# Altium project shutdown-rev2.PrjPCB
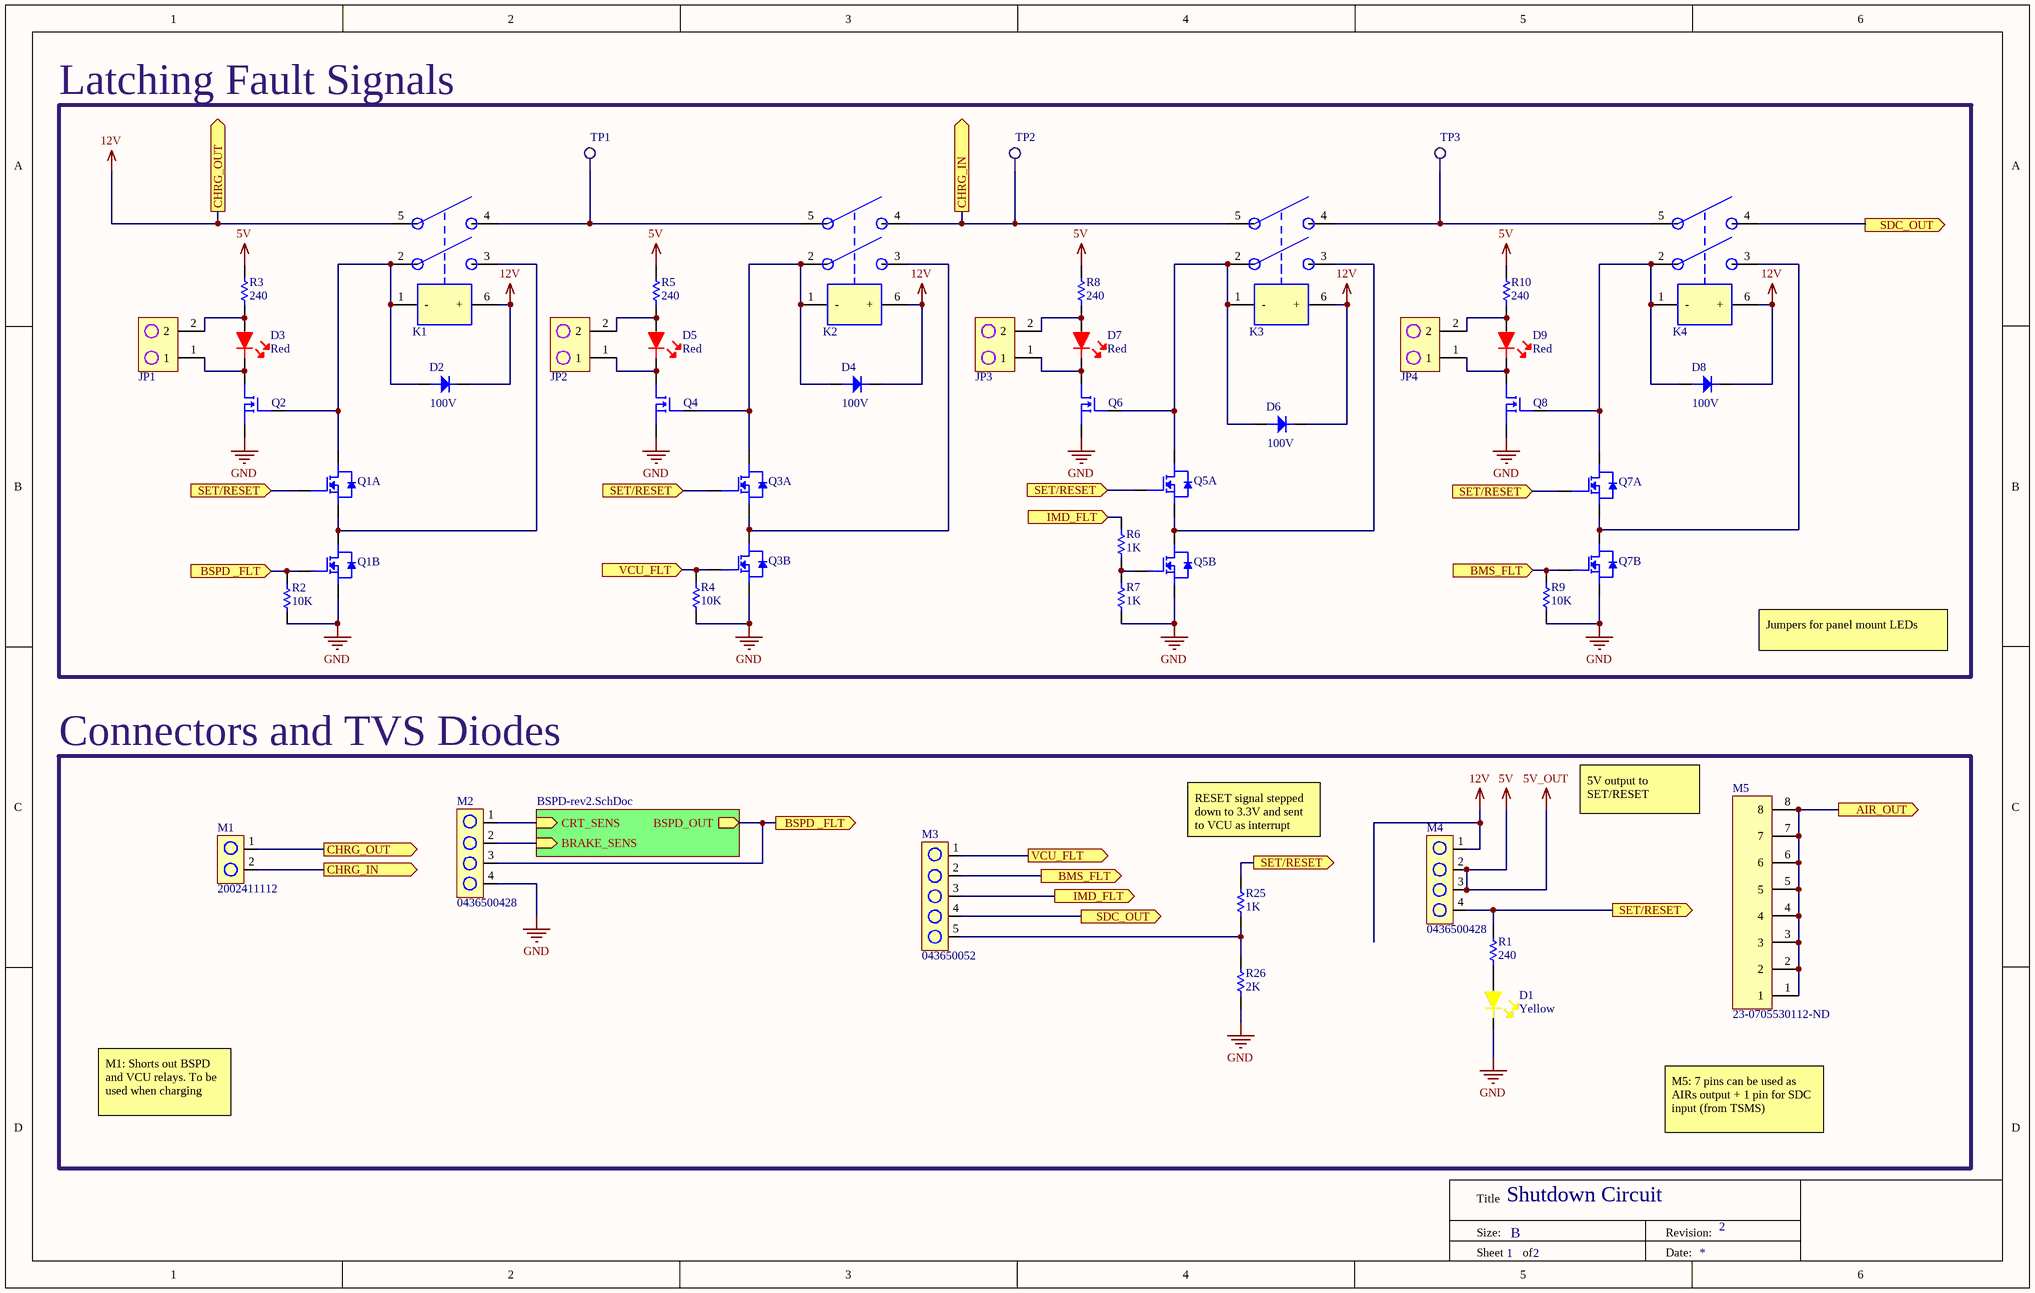
[diagram p0: SDC-rev2.SchDoc]
2 sheets, 79 parts. Net scope: hierarchical (ports join the sheet entries above them; power ports are global).
Board files: OLD_SDC-BSPD-rev2.PcbDoc, SDC-BSPD-rev2.PcbDoc
Sheets:
  SDC-rev2.SchDoc
    U_BSPD-rev2 = BSPD-rev2.SchDoc

## Sheet SDC-rev2.SchDoc
size B

### Parts
D1  Yellow  [LED-0603]
D2  100V  [DO-214AA]
D3  Red  [LED-0603]
D4  100V  [DO-214AA]
D5  Red  [LED-0603]
D6  100V  [DO-214AA]
D7  Red  [LED-0603]
D8  100V  [DO-214AA]
D9  Red  [LED-0603]
JP1  732-5315-ND  [2PIN-JP]  (value not drawn)
JP2  732-5315-ND  [2PIN-JP]  (value not drawn)
JP3  732-5315-ND  [2PIN-JP]  (value not drawn)
JP4  732-5315-ND  [2PIN-JP]  (value not drawn)
K1  5-1419124-6  [RELAY DPST SDC]  (value not drawn)
K2  5-1419124-6  [RELAY DPST SDC]  (value not drawn)
K3  5-1419124-6  [RELAY DPST SDC]  (value not drawn)
K4  5-1419124-6  [RELAY DPST SDC]  (value not drawn)
M1  2002411112  [2-PIN MOLEX]
M2  0436500428  [4-PIN MOLEX]
M3  043650052  [5-PIN MOLEX]
M4  0436500428  [4-PIN MOLEX]
M5  23-0705530112-ND  [8PIN]
Q1  DMN63D1LDW  [DMN63D1LDW]  (value not drawn)  (parts A,B of 2)
Q2  DMN6140L-13DICT-ND  [SOT-23-3]  (value not drawn)
Q3  DMN63D1LDW  [DMN63D1LDW]  (value not drawn)  (parts A,B of 2)
Q4  DMN6140L-13DICT-ND  [SOT-23-3]  (value not drawn)
Q5  DMN63D1LDW  [DMN63D1LDW]  (value not drawn)  (parts A,B of 2)
Q6  DMN6140L-13DICT-ND  [SOT-23-3]  (value not drawn)
Q7  DMN63D1LDW  [DMN63D1LDW]  (value not drawn)  (parts A,B of 2)
Q8  DMN6140L-13DICT-ND  [SOT-23-3]  (value not drawn)
R1  240  [RES-0603]
R2  10K  [RES-0603]
R3  240  [RES-0603]
R4  10K  [RES-0603]
R5  240  [RES-0603]
R6  1K  [RES-0603]
R7  1K  [RES-0603]
R8  240  [RES-0603]
R9  10K  [RES-0603]
R10  240  [RES-0603]
R25  1K  [RES-0603]
R26  2K  [RES-0603]
TP1  Testpoint2  [TP2]  (value not drawn)
TP2  Testpoint2  [TP2]  (value not drawn)
TP3  Testpoint2  [TP2]  (value not drawn)

### Blocks framed on the sheet
Latching Fault Signals: D2-D9 JP1-JP4 K1-K4 Q1-Q8 R2-R10 TP1-TP3
Connectors and TVS Diodes: D1 M1-M5 R1 R25 R26

### Sub-sheets
U_BSPD-rev2 = BSPD-rev2.SchDoc: CRT_SENS (in), BRAKE_SENS (in), BSPD_OUT (out)

### Ports
AIR_OUT (out), BMS_FLT (in), BMS_FLT (out), BSPD _FLT (in), BSPD _FLT (out), CHRG_IN (out), CHRG_OUT (out), IMD_FLT (in), IMD_FLT (out), SDC_OUT (out), SET/RESET (in), SET/RESET (out), VCU_FLT (in), VCU_FLT (out)

### Nets
5V: M4.2 M4.3 R3.2 R5.2 R8.2 R10.2  [also labelled 5V_OUT]
12V: D2.1 D4.1 D6.1 D8.1 K1.5 K1.6(+) K2.6(+) K3.6(+) K4.6(+) M1.1 M4.1 ; port CHRG_OUT
GND: D1.2 M2.4 Q1.4(S2) Q2.3 Q3.4(S2) Q4.3 Q5.4(S2) Q6.3 Q7.4(S2) Q8.3 R2.2 R4.2 R7.2 R9.2 R26.1
NetC1_2: M2.1 ; sheet U_BSPD-rev2/CRT_SENS
NetC3_2: M2.2 ; sheet U_BSPD-rev2/BRAKE_SENS
NetD1_1: D1.1 R1.1
NetD2_2: D2.2 K1.1(-) K1.2 Q1.6(D1) Q2.1
NetD3_1: D3.1 JP1.2 R3.1
NetD3_2: D3.2 JP1.1 Q2.2
NetD4_2: D4.2 K2.1(-) K2.2 Q3.6(D1) Q4.1
NetD5_1: D5.1 JP2.2 R5.1
NetD5_2: D5.2 JP2.1 Q4.2
NetD6_2: D6.2 K3.1(-) K3.2 Q5.6(D1) Q6.1
NetD7_1: D7.1 JP3.2 R8.1
NetD7_2: D7.2 JP3.1 Q6.2
NetD8_2: D8.2 K4.1(-) K4.2 Q7.6(D1) Q8.1
NetD9_1: D9.1 JP4.2 R10.1
NetD9_2: D9.2 JP4.1 Q8.2
NetK1_3: K1.3 Q1.1(S1) Q1.3(D2)
NetK1_4: K1.4 K2.5 TP1.1
NetK2_3: K2.3 Q3.1(S1) Q3.3(D2)
NetK2_4: K2.4 K3.5 M1.2 TP2.1 ; port CHRG_IN
NetK3_3: K3.3 Q5.1(S1) Q5.3(D2)
NetK3_4: K3.4 K4.5 TP3.1
NetK4_3: K4.3 Q7.1(S1) Q7.3(D2)
NetK4_4: K4.4 M3.4 ; port SDC_OUT
NetM2_3: M2.3 Q1.5(G2) R2.1 ; port BSPD _FLT, sheet U_BSPD-rev2/BSPD_OUT
NetM3_1: M3.1 Q3.5(G2) R4.1 ; port VCU_FLT
NetM3_2: M3.2 Q7.5(G2) R9.1 ; port BMS_FLT
NetM3_3: M3.3 R6.1 ; port IMD_FLT
NetM3_5: M3.5 R25.1 R26.2
NetM4_4: M4.4 Q1.2(G1) Q3.2(G1) Q5.2(G1) Q7.2(G1) R1.2 R25.2 ; port SET/RESET
NetM5_1: M5.1 M5.2 M5.3 M5.4 M5.5 M5.6 M5.7 M5.8 ; port AIR_OUT
NetQ5_5: Q5.5(G2) R6.2 R7.1

### Notes on the sheet
- Jumpers for panel mount LEDs
- (near R25) RESET signal stepped down to 3.3V and sent to VCU as interrupt
- 5V output to SET/RESET
- M1: Shorts out BSPD and VCU relays. To be used when charging
- M5: 7 pins can be used as AIRs output + 1 pin for SDC input (from TSMS)
- Shutdown Circuit
- 2
- 1
- Title
- Size:
- B
- Revision:
- Sheet
- of
- Date:

### Library data of the parts
D1 = LED-Yellow: LED YELLOW CLEAR 0603 SMD; Manufacturer: Wurth Electronics; Manufacturer Part Number: 150060YS75000; Viewing Angle: 140°; Lens Style: Clear,Rectangular; Wavelength: 590nm; Luminous Intensity: 120mcd; Forward Voltage: 2V; Forward Current: 30mA; Test Current: 20mA; Supplier 1: Digi-Key; Stock 1: 78; Pricing 1: 1=0.14, 50=0.133, 100=0.114, 500=0.099 (USD); Mount: Surface Mount; Case/Package: 0603; Case Code (Metric): 1608; Case Code (Imperial): 0603; Color: Yellow; Min Operating Temperature: -40°C; Max Operating Temperature: 85°C; Package Quantity: 4000; Packaging: Tape and Reel; Dominant Wavelength: 590nm; Length: 1.6mm; Height: 0.7mm; Width: 0.8mm; REACH SVHC: Unknown; ComponentLink1URL: http://katalog.we-online.de/led/datasheet/150060YS75000.pdf?src-supplier=Newark; ComponentLink1Description: http://katalog.we-online.de/led/datasheet/150060YS75000.pdf?src-supplier=Newark; ComponentLink2URL: https://katalog.we-online.de/led/datasheet/150060YS75000.pdf?src-supplier=Digi-Key; ComponentLink2Description: https://katalog.we-online.de/led/datasheet/150060YS75000.pdf?src-supplier=Digi-Key; ComponentLink3URL: http://www.farnell.com/datasheets/1911348.pdf?src-supplier=Element14; ComponentLink3Description: http://www.farnell.com/datasheets/1911348.pdf?src-supplier=Element14; ComponentLink4URL: https://www.distrelec.biz/Web/Downloads/_t/ds/150060YS75000_eng_tds.pdf?mime=application%2Fpdf&src-supplier=Distrelec; ComponentLink4Description: https://www.distrelec.biz/Web/Downloads/_t/ds/150060YS75000_eng_tds.pdf?mime=application%2Fpdf&src-supplier=Distrelec; ComponentLink5URL: http://www.produktinfo.conrad.com/datenblaetter/750000-774999/759432-da-01-en-CHIPLED_0603_W_KL_GELB_150060YS75000.pdf?src-supplier=Conrad; ComponentLink5Description: http://www.produktinfo.conrad.com/datenblaetter/750000-774999/759432-da-01-en-CHIPLED_0603_W_KL_GELB_150060YS75000.pdf?src-supplier=Conrad; Supplier Part Number 1: 732-4981-6-ND
D2 D4 D6 D8 = Diode-600V-5A: DIODE GEN PURP 600V 5A SMB; Manufacturer: MCC; Manufacturer Part Number: SK510B-LTP; Mount: Surface Mount; Case/Package: SMB; Number of Pins: 2; Packaging: Tape and Reel; Average Rectified Current: 5A; Max Reverse Voltage (DC): 100V; ComponentLink1URL: http://components.arrow.com/part/dataview/49208388S301832N2022?src-supplier=Arrow; ComponentLink1Description: http://components.arrow.com/part/dataview/49208388S301832N2022?src-supplier=Arrow; ComponentLink2URL: http://www.mccsemi.com/up_pdf/SK52B-L-SK520B-L(DO-214AA).pdf?src-supplier=Digi-Key; ComponentLink2Description: http://www.mccsemi.com/up_pdf/SK52B-L-SK520B-L(DO-214AA).pdf?src-supplier=Digi-Key; Supplier 1: Digi-Key; Stock 1: 68219; Pricing 1: 1=0.4, 10=0.3, 25=0.2628, 100=0.1427, 250=0.14192, 500=0.11638, 1000=0.08634 (USD); ComponentLink3URL: http://www.smc-diodes.com/propdf/SD560B%20N1412%20REV.D.pdf?src-supplier=Digi-Key; ComponentLink3Description: http://www.smc-diodes.com/propdf/SD560B%20N1412%20REV.D.pdf?src-supplier=Digi-Key; Supplier Part Number 1: 1655-1530-6-ND
D3 D5 D7 D9 = LED-Red-Bright: LED RED CLEAR 0603 SMD; Manufacturer: Inolux; Manufacturer Part Number: IN-S63ATR; Lens Style: Flat; Luminous Intensity: 45mcd; Forward Voltage: 2.2V; Test Current: 20mA; Viewing Angle: 120°; Dominant Wavelength: 622nm; Lens Size: 0.8mm; Supplier 1: Digi-Key; Stock 1: 6977; Pricing 1: 1=0.33, 10=0.24, 100=0.1136, 500=0.07576, 1000=0.05934 (USD); Mount: Surface Mount; Case/Package: 0603; Color: Red; Lens Color: Clear; Case Code (Imperial): 0603; Case Code (Metric): 1608; Packaging: Cut Tape; Lens Transparency: Clear; Length: 1.6mm; Height: 0.4mm; Width: 0.8mm; ComponentLink1URL: http://www.inolux-corp.com/datasheet/SMDLED/Mono%20Color%20Top%20View/IN-S63AT%20Series_V1.1.pdf?src-supplier=Digi-Key; ComponentLink1Description: http://www.inolux-corp.com/datasheet/SMDLED/Mono%20Color%20Top%20View/IN-S63AT%20Series_V1.1.pdf?src-supplier=Digi-Key; Supplier Part Number 1: 1830-1065-6-ND
JP1-JP4 = 2PIN-TEST: CONN HEADER VERT 2POS 2.54MM
K1-K4 = 5-1419124-6: General Purpose Relay, Osa Series, Power, Non Latching, Dpst-No, 12 Vdc, 3 A Rohs Compliant: Yes; Manufacturer: TE Connectivity; Contact Current Rating: 3A; Coil Current: 45mA; Throw Configuration: DPST; Operate Time: 20ms; Release Time: 10ms; Coil Power: 600mW; Coil Resistance: 270R; Coil Type: Non-Latching; Coil Voltage (DC): 12V; Contact Voltage Rating (AC): 240V; Supplier 1: Digi-Key; Manufacturer Part Number: 5-1419124-6; Stock 1: 2593; Pricing 1: 1=2.54, 10=2.385, 25=2.1204, 50=2.0142, 100=1.9083, 250=1.69624, 500=1.59022, 1000=1.48421, 5000=1.4312 (USD); Mount: Through Hole; Weight: 13g; Contact Material: Silver; Min Operating Temperature: -30°C; Max Operating Temperature: 60°C; Package Quantity: 1000; Packaging: Box; Termination: PCB; Relay Type: General Purpose; Length: 24.4mm; Height: 0.976inch; Width: 12.9mm; ELV: Compliant; REACH SVHC: Unknown; ComponentLink1URL: http://www.farnell.com/datasheets/1652820.pdf?src-supplier=Farnell; ComponentLink1Description: http://www.farnell.com/datasheets/1652820.pdf?src-supplier=Farnell; ComponentLink2URL: http://www.farnell.com/cad/1652820.pdf?src-supplier=Element14; ComponentLink2Description: http://www.farnell.com/cad/1652820.pdf?src-supplier=Element14; ComponentLink3URL: http://www.te.com/commerce/DocumentDelivery/DDEController?Action=srchrtrv&DocNm=5-1419124-6&DocType=Customer+Drawing&DocLang=English&src-supplier=Digi-Key; ComponentLink3Description: http://www.te.com/commerce/DocumentDelivery/DDEController?Action=srchrtrv&DocNm=5-1419124-6&DocType=Customer+Drawing&DocLang=English&src-supplier=Digi-Key; Supplier Part Number 1: OSA-SS-212DM3,000-ND; Category: Relays
M1 = 2002411112: CONN HEADER VERT 2POS 5.7MM, 12-16AWG
M2 M4 = 0436500428: 4 PIN HDR, 3MM PITCH, 18-30 AWG; Manufacturer: Molex; Number of Positions: 4; Connector Type: Male Pin; Number of Ports: 1; Supplier 1: Digi-Key; Manufacturer Part Number: 0436500428; Stock 1: 1193; Pricing 1: 1=1.44, 10=1.265, 100=1.0916, 500=0.89316, 1000=0.79392, 5000=0.69468, 10000=0.65995 (USD); Mount: Through Hole; Contact Plating: Gold; Color: Black; Contact Material: Brass; Housing Material: Polymer; Number of Terminals: 4; Min Operating Temperature: -40°C; Max Operating Temperature: 105°C; Packaging: Tray; Number of Rows: 1; Termination: Solder; Fastening Type: Ramp; Number of Contacts: 4; Orientation: Straight; Package Quantity: 2040; Length: 15.65mm; Pitch: 3mm; Depth: 5.57mm; ComponentLink1URL: http://www.molex.com/pdm_docs/sd/436500428_sd.pdf?src-supplier=Digi-Key; ComponentLink1Description: http://www.molex.com/pdm_docs/sd/436500428_sd.pdf?src-supplier=Digi-Key; ComponentLink2URL: http://www.molex.com/webdocs/datasheets/pdf/en-us/0436500428_PCB_HEADERS.pdf?src-supplier=Avnet; ComponentLink2Description: http://www.molex.com/webdocs/datasheets/pdf/en-us/0436500428_PCB_HEADERS.pdf?src-supplier=Avnet; Supplier Part Number 1: WM10669-ND; Category: Connectors, Interconnects
M3 = 0436500528: CONN HEADER VERT 5POS 3MM
M5 = 8PIN: CONN HEADER R/A 8POS 2.54MM; Manufacturer: Molex; Manufacturer Part Number: 70553-0112; Contact Resistance: 30mR; Current Rating: 3A; Voltage Rating: 250V; Number of Positions: 8; Insulation Resistance: 1GR; Connector Type: Male Pin; Glow Wire Compliant: Non-compliant; Supplier 1: Digi-Key; Stock 1: 1363; Pricing 1: 1=2.43, 10=2.205, 100=1.89, 500=1.575, 1000=1.35, 5000=1.197, 10000=1.17 (USD); Mount: Through Hole; Color: Black; Contact Material: Bronze; Contact Plating: Gold; Material: Brass; Housing Material: Thermoplastic; Min Operating Temperature: -40°C; Max Operating Temperature: 105°C; Package Quantity: 1; Number of Rows: 1; Packaging: Rail/Tube; Termination: Solder; Number of Contacts: 8; Orientation: Right Angle; Voltage Rating (DC): 250V; Number of Circuits: 8; Pitch: 2.54mm; Contact Mating Length: 0.24inch; ELV: Compliant; Flammability Rating: UL94 V-0; ComponentLink1URL: https://www.molex.com/pdm_docs/ps/PS-70400.pdf?src-supplier=Digi-Key; ComponentLink1Description: https://www.molex.com/pdm_docs/ps/PS-70400.pdf?src-supplier=Digi-Key; ComponentLink2URL: http://www.mouser.com/ds/2/276/0705530112_PCB_HEADERS-172840.pdf?src-supplier=Mouser; ComponentLink2Description: http://www.mouser.com/ds/2/276/0705530112_PCB_HEADERS-172840.pdf?src-supplier=Mouser; Supplier Part Number 1: 23-0705530112-ND
Q1 Q3 Q5 Q7 = DMN63D1LDW: MOSFET 2N-CH 60V 0.25A SOT363; Manufacturer: Toshiba; Manufacturer Part Number: SSM6N7002CFU,LF; Continuous Drain Current (ID): 170mA; Rds On Max: 3.9R; Input Capacitance: 17pF; Max Power Dissipation: 285mW; FET Type: 2 N-Channel; Supplier 1: Digi-Key; Stock 1: 13946; Pricing 1: 1=0.27, 10=0.221, 100=0.0906, 500=0.0756, 1000=0.05253 (USD); Mount: Surface Mount; Case/Package: SOT-363; Packaging: Tape and Reel; Drain to Source Voltage (Vdss): 60V; ComponentLink1URL: https://toshiba.semicon-storage.com/info/docget.jsp?did=29875&prodName=SSM6N7002CFU&src-supplier=Digi-Key; ComponentLink1Description: https://toshiba.semicon-storage.com/info/docget.jsp?did=29875&prodName=SSM6N7002CFU&src-supplier=Digi-Key; ComponentLink2URL: http://www.mouser.com/ds/2/408/SSM6N7002CFU_datasheet_en_20150413-736631.pdf?src-supplier=Mouser; ComponentLink2Description: http://www.mouser.com/ds/2/408/SSM6N7002CFU_datasheet_en_20150413-736631.pdf?src-supplier=Mouser; Category: Discrete Semiconductor Products; Supplier Part Number 1: SSM6N7002CFULFDKR-ND
Q2 Q4 Q6 Q8 = N-FET-60V-1.6A: MOSFET N-CH 60V 1.6A SOT23; Manufacturer: Diodes; Rds On Max: 140mR; Input Capacitance: 315pF; Max Power Dissipation: 700mW; Supplier 1: Digi-Key; Manufacturer Part Number: DMN6140L-13; Stock 1: 274948; Pricing 1: 1=0.34, 10=0.256, 25=0.224, 100=0.1217, 250=0.12104, 500=0.09926, 1000=0.07365, 2500=0.06468, 5000=0.05924 (USD); Mount: Surface Mount; Case/Package: TO-236-3; Min Operating Temperature: -55°C; Max Operating Temperature: 150°C; Package Quantity: 10000; Packaging: Cut Tape; Drain to Source Voltage (Vdss): 60V; Continuous Drain Current (ID): 1.6A; ComponentLink1URL: https://www.diodes.com/assets/Datasheets/DMN6140L.pdf?src-supplier=Digi-Key; ComponentLink1Description: https://www.diodes.com/assets/Datasheets/DMN6140L.pdf?src-supplier=Digi-Key; Supplier Part Number 1: DMN6140L-13DIDKR-ND
R1 R3 R5 R8 R10 R25 = ESR03EZPJ241: RES SMD 240 OHM 5% 1/4W 0603; Manufacturer: Vishay; Manufacturer Part Number: CRCW0603220RJNEA; Resistance: 220R; Power Rating: 100mW; Voltage Rating: 75V; Temperature Coefficient: 200ppm/°C; Supplier 1: Digi-Key; Stock 1: 171552; Pricing 1: 1=0.1, 10=0.031, 100=0.0125, 1000=0.00562, 2500=0.00488 (USD); Mount: Surface Mount; Case/Package: 0603; Weight: 7.1E-05oz; Case Code (Metric): 1608; Case Code (Imperial): 0603; Contact Plating: Tin; Min Operating Temperature: -55°C; Max Operating Temperature: 155°C; Tolerance: 5%; Packaging: Tape and Reel; Package Quantity: 1; Composition: Thick Film; Number of Terminations: 2; Military Standard: Not; Termination: SMD/SMT; Max Power Dissipation: 100mW; Working Voltage: 75V; Features: Automotive AEC-Q200; Length: 1.55mm; Height: 0.45mm; Width: 0.033inch; Depth: 0.85mm; Radiation Hardening: No; REACH SVHC: Unknown; ComponentLink1URL: http://www.vishay.com/docs/20035/dcrcwe3.pdf?src-supplier=Digi-Key; ComponentLink1Description: http://www.vishay.com/docs/20035/dcrcwe3.pdf?src-supplier=Digi-Key; ComponentLink2URL: http://www.vishay.com/docs/20035/dcrcwe3.pdf?src-supplier=Avnet; ComponentLink2Description: http://www.vishay.com/docs/20035/dcrcwe3.pdf?src-supplier=Avnet; ComponentLink3URL: http://www.alliedelec.com/m/d/0c934d6939ccefa68dbe0b96d821c8cf.pdf?src-supplier=Allied+Electronics; ComponentLink3Description: http://www.alliedelec.com/m/d/0c934d6939ccefa68dbe0b96d821c8cf.pdf?src-supplier=Allied+Electronics; ComponentLink4URL: http://www.farnell.com/datasheets/2045673.pdf?src-supplier=Element14; ComponentLink4Description: http://www.farnell.com/datasheets/2045673.pdf?src-supplier=Element14; ComponentLink5URL: http://www.mouser.com/ds/2/427/dcrcwe3-109170.pdf?src-supplier=Mouser; ComponentLink5Description: http://www.mouser.com/ds/2/427/dcrcwe3-109170.pdf?src-supplier=Mouser; Supplier Part Number 1: 541-220GCT-ND; Category: Resistors
R2 R4 R9 = CRCW060310K0FKEA: RES SMD 10K OHM 1% 1/10W 0603; Manufacturer: Vishay; Resistance: 10kR; Temperature Coefficient: 100ppm/°C; Power Rating: 100mW; Voltage Rating: 75V; Supplier 1: Digi-Key; Manufacturer Part Number: CRCW060310K0FKEA; Stock 1: 1434373; Pricing 1: 1=0.1, 10=0.034, 100=0.0139, 1000=0.00623, 2500=0.0054 (USD); Case/Package: 0603; Number of Pins: 2; Weight: 7.1E-05oz; Contact Plating: Tin,Lead; Case Code (Metric): 1608; Case Code (Imperial): 0603; Min Operating Temperature: -55°C; Max Operating Temperature: 155°C; Tolerance: 1%; Composition: Thick Film; Packaging: Tape and Reel; Package Quantity: 10; Number of Terminations: 2; Military Standard: Not; Termination: SMD/SMT; Max Power Dissipation: 100mW; Voltage Rating (DC): 75V; Features: Automotive AEC-Q200; Length: 1.55mm; Height: 0.45mm; Width: 0.033inch; Depth: 0.85mm; Radiation Hardening: No; Lead Free: Lead Free; REACH SVHC: Unknown; ComponentLink1URL: http://www.vishay.com/docs/20008/dcrcw.pdf?src-supplier=Avnet+Europe; ComponentLink1Description: http://www.vishay.com/docs/20008/dcrcw.pdf?src-supplier=Avnet+Europe; ComponentLink2URL: https://www.verical.com/server-webapp/html/getDatasheet?partID=86831&src-supplier=Verical; ComponentLink2Description: https://www.verical.com/server-webapp/html/getDatasheet?partID=86831&src-supplier=Verical; ComponentLink3URL: http://www.farnell.com/datasheets/2310790.pdf?src-supplier=Allied+Electronics; ComponentLink3Description: http://www.farnell.com/datasheets/2310790.pdf?src-supplier=Allied+Electronics; ComponentLink4URL: http://www.vishay.com/docs/20035/dcrcwe3.pdf?src-supplier=Digi-Key; ComponentLink4Description: http://www.vishay.com/docs/20035/dcrcwe3.pdf?src-supplier=Digi-Key; ComponentLink5URL: http://www.farnell.com/datasheets/2310790.pdf?src-supplier=Mouser; ComponentLink5Description: http://www.farnell.com/datasheets/2310790.pdf?src-supplier=Mouser; ComponentLink6URL: http://www.farnell.com/datasheets/2310790.pdf?src-supplier=Element14; ComponentLink6Description: http://www.farnell.com/datasheets/2310790.pdf?src-supplier=Element14; ComponentLink7URL: http://www.farnell.com/datasheets/2310790.pdf?src-supplier=Avnet; ComponentLink7Description: http://www.farnell.com/datasheets/2310790.pdf?src-supplier=Avnet; ComponentLink8URL: http://www.vishay.com/docs/20035/dcrcwe3.pdf?src-supplier=Future+Electronics; ComponentLink8Description: http://www.vishay.com/docs/20035/dcrcwe3.pdf?src-supplier=Future+Electronics; ComponentLink9URL: http://uk.rs-online.com/webdocs/0d98/0900766b80d98afc.pdf?src-supplier=RSComponents; ComponentLink9Description: http://uk.rs-online.com/webdocs/0d98/0900766b80d98afc.pdf?src-supplier=RSComponents; ComponentLink10URL: http://www.farnell.com/datasheets/2310790.pdf?src-supplier=Distrelec; ComponentLink10Description: http://www.farnell.com/datasheets/2310790.pdf?src-supplier=Distrelec; Supplier Part Number 1: 541-10.0KHCT-ND; Category: Resistors
R6 R7 = CRCW06031K00FKEA: RES SMD 1K OHM 1% 1/10W 0603; Manufacturer: Vishay Dale; Resistance: 1kR; Temperature Coefficient: 100ppm/°C; Power Rating: 100mW; Voltage Rating: 75V; Supplier 1: Digi-Key; Manufacturer Part Number: CRCW06031K00FKEA; Stock 1: 1811474; Pricing 1: 1=0.1, 10=0.034, 100=0.0139, 1000=0.00623, 2500=0.0054 (USD); Mount: Surface Mount; Case/Package: 0603; Number of Pins: 2; Weight: 7.1E-05oz; Contact Plating: Tin; Case Code (Metric): 1608; Case Code (Imperial): 0603; Min Operating Temperature: -55°C; Max Operating Temperature: 155°C; Composition: Thick Film; Tolerance: 1%; Termination: SMD/SMT; Packaging: Tape and Reel; Package Quantity: 10; Number of Terminations: 2; Military Standard: Not; Max Power Dissipation: 100mW; Voltage Rating (DC): 75V; Features: Automotive AEC-Q200; Length: 1.55mm; Height: 0.45mm; Width: 0.033inch; Depth: 0.85mm; Radiation Hardening: No; Lead Free: Lead Free; REACH SVHC: Unknown; ComponentLink1URL: http://www.vishay.com/docs/20035/dcrcwe3.pdf?src-supplier=Digi-Key; ComponentLink1Description: http://www.vishay.com/docs/20035/dcrcwe3.pdf?src-supplier=Digi-Key; ComponentLink2URL: http://uk.rs-online.com/webdocs/0d98/0900766b80d98afc.pdf?src-supplier=RSComponents; ComponentLink2Description: http://uk.rs-online.com/webdocs/0d98/0900766b80d98afc.pdf?src-supplier=RSComponents; ComponentLink3URL: http://www.vishay.com/docs/20035/dcrcwe3.pdf?src-supplier=Avnet; ComponentLink3Description: http://www.vishay.com/docs/20035/dcrcwe3.pdf?src-supplier=Avnet; ComponentLink4URL: http://www.vishay.com/docs/20035/dcrcwe3.pdf?src-supplier=Avnet+Asia; ComponentLink4Description: http://www.vishay.com/docs/20035/dcrcwe3.pdf?src-supplier=Avnet+Asia; ComponentLink5URL: http://www.farnell.com/datasheets/2310790.pdf?src-supplier=Element14; ComponentLink5Description: http://www.farnell.com/datasheets/2310790.pdf?src-supplier=Element14; ComponentLink6URL: https://www.distrelec.biz/Web/Downloads/a_/en/flD-CRCW-e3_data_en.pdf?mime=application%2Fpdf&src-supplier=Distrelec; ComponentLink6Description: https://www.distrelec.biz/Web/Downloads/a_/en/flD-CRCW-e3_data_en.pdf?mime=application%2Fpdf&src-supplier=Distrelec; ComponentLink7URL: http://www.vishay.com/docs/20035/dcrcwe3.pdf?src-supplier=Future+Electronics; ComponentLink7Description: http://www.vishay.com/docs/20035/dcrcwe3.pdf?src-supplier=Future+Electronics; ComponentLink8URL: http://www.vishay.com/docs/20035/dcrcwe3.pdf?src-supplier=Avnet+Europe; ComponentLink8Description: http://www.vishay.com/docs/20035/dcrcwe3.pdf?src-supplier=Avnet+Europe; Supplier Part Number 1: 541-1.00KHCT-ND; Category: Resistors
R26 = ERA-3AEB202V: RES SMD 2K OHM 0.1% 1/10W 0603; Manufacturer: Vishay Dale; Manufacturer Part Number: CRCW06031K00FKEA; Resistance: 1kR; Tolerance: 1%; Temperature Coefficient: 100ppm/°C; Power Rating: 100mW; Voltage Rating: 75V; Supplier 1: Digi-Key; Stock 1: 1811474; Pricing 1: 1=0.1, 10=0.034, 100=0.0139, 1000=0.00623, 2500=0.0054 (USD); Mount: Surface Mount; Case/Package: 0603; Number of Pins: 2; Weight: 7.1E-05oz; Contact Plating: Tin; Case Code (Metric): 1608; Case Code (Imperial): 0603; Min Operating Temperature: -55°C; Max Operating Temperature: 155°C; Composition: Thick Film; Termination: SMD/SMT; Packaging: Tape and Reel; Package Quantity: 10; Number of Terminations: 2; Military Standard: Not; Max Power Dissipation: 100mW; Voltage Rating (DC): 75V; Features: Automotive AEC-Q200; Length: 1.55mm; Height: 0.45mm; Width: 0.033inch; Depth: 0.85mm; Radiation Hardening: No; Lead Free: Lead Free; REACH SVHC: Unknown; ComponentLink1URL: http://www.vishay.com/docs/20035/dcrcwe3.pdf?src-supplier=Digi-Key; ComponentLink1Description: http://www.vishay.com/docs/20035/dcrcwe3.pdf?src-supplier=Digi-Key; ComponentLink2URL: http://uk.rs-online.com/webdocs/0d98/0900766b80d98afc.pdf?src-supplier=RSComponents; ComponentLink2Description: http://uk.rs-online.com/webdocs/0d98/0900766b80d98afc.pdf?src-supplier=RSComponents; ComponentLink3URL: http://www.vishay.com/docs/20035/dcrcwe3.pdf?src-supplier=Avnet; ComponentLink3Description: http://www.vishay.com/docs/20035/dcrcwe3.pdf?src-supplier=Avnet; ComponentLink4URL: http://www.vishay.com/docs/20035/dcrcwe3.pdf?src-supplier=Avnet+Asia; ComponentLink4Description: http://www.vishay.com/docs/20035/dcrcwe3.pdf?src-supplier=Avnet+Asia; ComponentLink5URL: http://www.farnell.com/datasheets/2310790.pdf?src-supplier=Element14; ComponentLink5Description: http://www.farnell.com/datasheets/2310790.pdf?src-supplier=Element14; ComponentLink6URL: https://www.distrelec.biz/Web/Downloads/a_/en/flD-CRCW-e3_data_en.pdf?mime=application%2Fpdf&src-supplier=Distrelec; ComponentLink6Description: https://www.distrelec.biz/Web/Downloads/a_/en/flD-CRCW-e3_data_en.pdf?mime=application%2Fpdf&src-supplier=Distrelec; ComponentLink7URL: http://www.vishay.com/docs/20035/dcrcwe3.pdf?src-supplier=Future+Electronics; ComponentLink7Description: http://www.vishay.com/docs/20035/dcrcwe3.pdf?src-supplier=Future+Electronics; ComponentLink8URL: http://www.vishay.com/docs/20035/dcrcwe3.pdf?src-supplier=Avnet+Europe; ComponentLink8Description: http://www.vishay.com/docs/20035/dcrcwe3.pdf?src-supplier=Avnet+Europe; Supplier Part Number 1: 541-1.00KHCT-ND; Category: Resistors
TP1-TP3 = Testpoint2: Single layer pad TP

## Sheet BSPD-rev2.SchDoc
size B
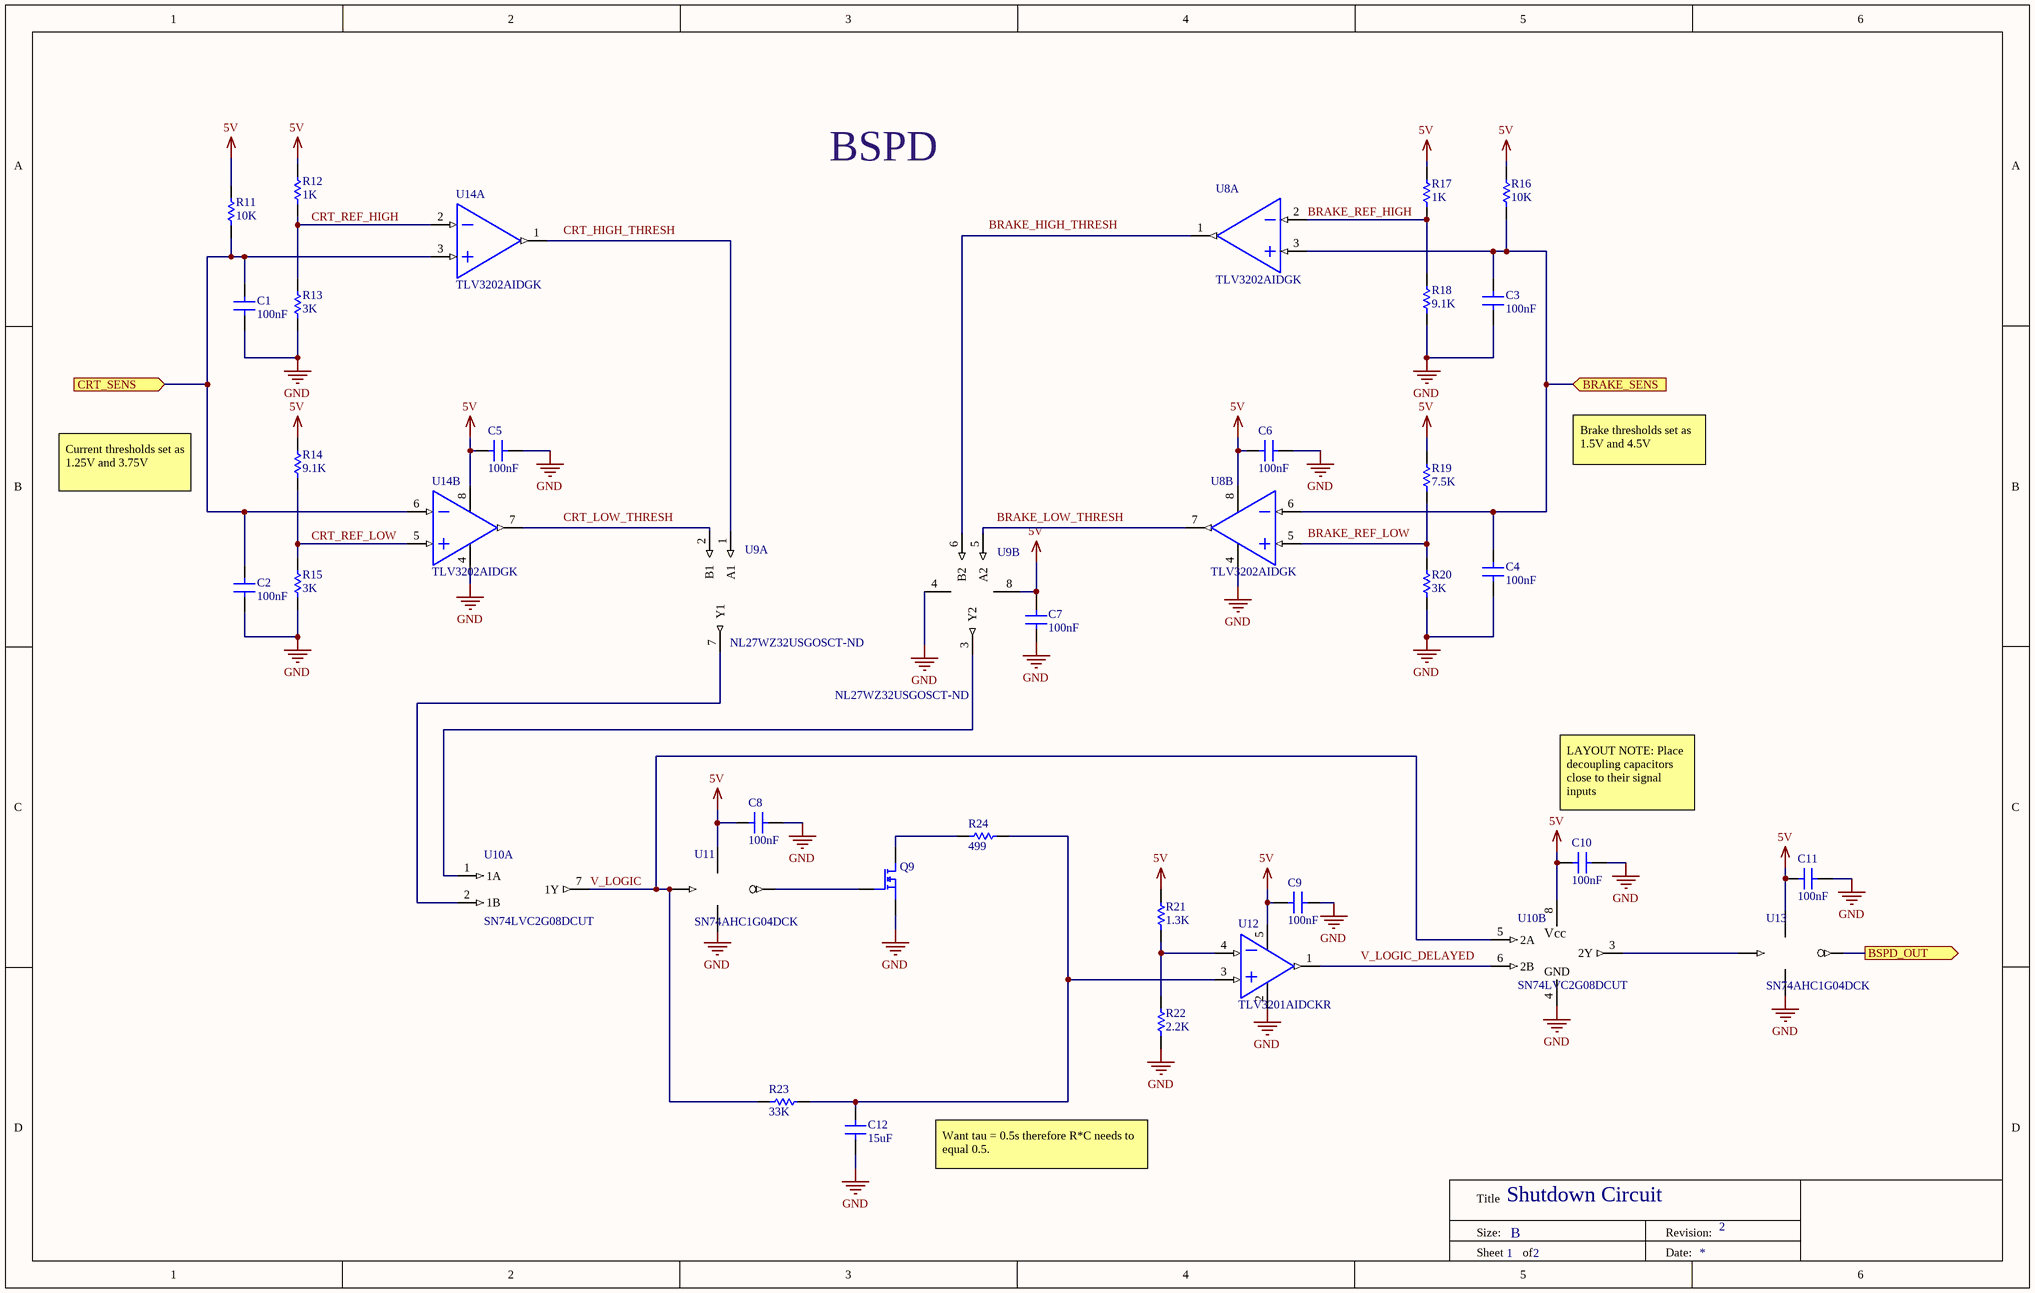
[diagram p1: BSPD-rev2.SchDoc]

### Parts
C1  100nF  [CAP-0603]
C2  100nF  [CAP-0603]
C3  100nF  [CAP-0603]
C4  100nF  [CAP-0603]
C5  100nF  [CAP-0603]
C6  100nF  [CAP-0603]
C7  100nF  [CAP-0603]
C8  100nF  [CAP-0603]
C9  100nF  [CAP-0603]
C10  100nF  [CAP-0603]
C11  100nF  [CAP-0603]
C12  15uF  [CAP-0603]
Q9  BSS138LT3G  [SOT-23-3]  (value not drawn)
R11  10K  [RES-0603]
R12  1K  [RES-0603]
R13  3K  [RES-0603]
R14  9.1K  [RES-0603]
R15  3K  [RES-0603]
R16  10K  [RES-0603]
R17  1K  [RES-0603]
R18  9.1K  [RES-0603]
R19  7.5K  [RES-0603]
R20  3K  [RES-0603]
R21  1.3K  [RES-0603]
R22  2.2K  [RES-0603]
R23  33K  [RES-0603]
R24  499  [RES-0603]
U8  TLV3202AIDGK  [TLV3202AIDGK]  (parts A,B of 2)
U9  NL27WZ32USGOSCT-ND  [TSSOP50P310X90-8N]  (parts A,B of 2)
U10  SN74LVC2G08DCUT  [SN74LVC2G08DCU]  (parts A,B of 2)
U11  SN74AHC1G04DCK  [SN74AHC1G04DCK]
U12  TLV3201AIDCKR  [TLV3201AIDCK]
U13  SN74AHC1G04DCK  [SN74AHC1G04DCK]
U14  TLV3202AIDGK  [TLV3202AIDGK]  (parts A,B of 2)

### Ports
BRAKE_SENS (in), BSPD_OUT (out), CRT_SENS (in)

### Nets
5V: C5.2 C6.2 C7.1 C8.2 C9.1 C10.2 C11.2 R11.2 R12.2 R14.2 R16.2 R17.2 R19.2 R21.2 U8.8(VCC) U9.8(VCC) U10.8(VCC) U11.5(VCC) U12.5(VCC) U13.5(VCC) U14.8(VCC)
GND: C1.1 C2.1 C3.1 C4.1 C5.1 C6.1 C7.2 C8.1 C9.2 C10.1 C11.1 C12.1 Q9.2 R13.1 R15.1 R18.1 R20.1 R22.1 U8.4(GND) U9.4(GND) U10.4(GND) U12.2(GND) U13.3(GND) U14.4(GND)
BRAKE_REF_HIGH: R17.1 R18.2 U8.2(1IN-)
CRT_REF_HIGH: R12.1 R13.2 U14.2(1IN-)
CRT_REF_LOW: R14.1 R15.2 U14.5(2IN+)
V_LOGIC: R23.1 U10.5(2A) U10.7(1Y) U11.2(A)
NetC1_2: C1.2 C2.2 R11.1 U14.3(1IN+) U14.6(2IN-) ; port CRT_SENS
NetC3_2: C3.2 C4.2 R16.1 U8.3(1IN+) U8.6(2IN-) ; port BRAKE_SENS
NetC12_2: C12.2 R23.2 R24.2 U12.3(1IN+)
NetM2_3: U13.4(Y) ; port BSPD_OUT
NetQ9_1: Q9.1 U11.4(Y)
NetQ9_3: Q9.3 R24.1
NetR19_1: R19.1 R20.2 U8.5(2IN+)
NetR21_1: R21.1 R22.2 U12.4(1IN-)
NetU8_1: U8.1(1OUT) U9.6(B2)
NetU8_7: U8.7(2OUT) U9.5(A2)
NetU9_1: U9.1(A1) U14.1(1OUT)
NetU9_2: U9.2(B1) U14.7(2OUT)
NetU9_3: U9.3(Y2) U10.1(1A)
NetU9_7: U9.7(Y1) U10.2(1B)
NetU10_3: U10.3(2Y) U13.2(A)
NetU10_6: U10.6(2B) U12.1(1OUT)

Not connected (* = marked no-connect by the designer): U11 3(GND)

### Notes on the sheet
- BSPD
- Current thresholds set as 1.25V and 3.75V
- Brake thresholds set as 1.5V and 4.5V
- (near C10) LAYOUT NOTE: Place decoupling capacitors close to their signal inputs
- Want tau = 0.5s therefore R*C needs to equal 0.5.
- Shutdown Circuit
- 2
- 1
- Labels drawn without touching a wire or pin: BRAKE_HIGH_THRESH, BRAKE_LOW_THRESH, BRAKE_REF_LOW, CRT_HIGH_THRESH, CRT_LOW_THRESH, GND, V_LOGIC_DELAYED
- Title
- Size:
- B
- Revision:
- Sheet
- of
- Date:
- (in symbol SN74LVC2G08DCUT, part B) Vcc

### Library data of the parts
C1-C11 = CL10B104KB8NNNL: CAP CER 0.1UF 50V X7R 0603; Manufacturer: Samsung; Manufacturer Part Number: CL21A106KPFNNNG; Capacitance: 10uF; Tolerance: 10%; Dielectric: X5R; Voltage: 10V; Supplier 1: Digi-Key; Stock 1: 0; Pricing 1: 1=0.15, 10=0.104, 100=0.0489, 500=0.03428, 1000=0.02837 (USD); Mount: Surface Mount; Case/Package: 0805; Case Code (Metric): 2012; Case Code (Imperial): 0805; Min Operating Temperature: -55°C; Max Operating Temperature: 85°C; Voltage Rating: 10V; Packaging: Tape and Reel; Package Quantity: 3000; Termination: Wraparound; Length: 2mm; Height: 1.25mm; Depth: 1.25mm; Width: 0.049inch; Thickness: 0.053inch; Radiation Hardening: No; Lead Free: Lead Free; ComponentLink1URL: http://www1.futureelectronics.com/doc/SAMSUNG/CL21A106KPFNNNG.pdf?src-supplier=Future+Electronics; ComponentLink1Description: http://www1.futureelectronics.com/doc/SAMSUNG/CL21A106KPFNNNG.pdf?src-supplier=Future+Electronics; ComponentLink2URL: https://www.verical.com/server-webapp/html/getDatasheet?partID=640497&src-supplier=Verical; ComponentLink2Description: https://www.verical.com/server-webapp/html/getDatasheet?partID=640497&src-supplier=Verical; Supplier Part Number 1: 1276-6456-1-ND
C12 = C1608X5R0J156M080AC: CAP CER 15UF 6.3V X5R 0603
Q9 = BSS138LT3G: MOSFET N-CH 50V 200MA SOT-23; Manufacturer: ON Semiconductor; Nominal Vgs: 500mV; Input Capacitance: 50pF; Number of Elements: 1; Max Power Dissipation: 225mW; Rds On Max: 3.5R; Turn-Off Delay Time: 20ns; Element Configuration: Single; Gate to Source Voltage (Vgs): 20V; Supplier 1: Digi-Key; Manufacturer Part Number: BSS138LT3G; Stock 1: 195647; Pricing 1: 1=0.45, 10=0.408, 100=0.2284, 500=0.12234, 1000=0.0832 (USD); Case/Package: SOT-23-3; Number of Pins: 3; Min Operating Temperature: -55°C; Max Operating Temperature: 150°C; Package Quantity: 1; Packaging: Tape and Reel; Drain to Source Voltage (Vdss): 50V; Continuous Drain Current (ID): 200mA; Drain to Source Breakdown Voltage: 50V; Power Dissipation: 225mW; Drain to Source Resistance: 3.5R; Threshold Voltage: 500mV; Turn-On Delay Time: 20ns; Voltage Rating (DC): 50V; Current Rating: 200mA; On-State Resistance: 3.5R; Length: 2.9mm; Height: 0.94mm; Width: 1.3mm; Radiation Hardening: No; REACH SVHC: No SVHC; Lead Free: Lead Free; Halogen Free: Halogen Free; Supplier Part Number 1: BSS138LT3GOSCT-ND; ComponentLink1Description: DigiKey; ComponentLink1URL: https://www.digikey.ca/product-detail/en/BSS138LT3G/BSS138LT3GOSCT-ND/2120566/?itemSeq=274498102
R11 R16 = CRCW060310K0FKEA: as R2 on sheet SDC-rev2; Supplier 1: Digi-Key; Manufacturer Part Number: CRCW060310K0FKEA; Stock 1: 1434373; Pricing 1: 1=0.1, 10=0.034, 100=0.0139, 1000=0.00623, 2500=0.0054 (USD); Case/Package: 0603; Number of Pins: 2; Weight: 7.1E-05oz; Contact Plating: Tin,Lead; Case Code (Metric): 1608; Case Code (Imperial): 0603; Min Operating Temperature: -55°C; Max Operating Temperature: 155°C; Tolerance: 1%; Composition: Thick Film; Packaging: Tape and Reel; Package Quantity: 10; Number of Terminations: 2; Military Standard: Not; Termination: SMD/SMT; Max Power Dissipation: 100mW; Voltage Rating (DC): 75V; Features: Automotive AEC-Q200; Length: 1.55mm; Height: 0.45mm; Width: 0.033inch; Depth: 0.85mm; Radiation Hardening: No; Lead Free: Lead Free; REACH SVHC: Unknown; ComponentLink1URL: http://www.vishay.com/docs/20008/dcrcw.pdf?src-supplier=Avnet+Europe; ComponentLink1Description: http://www.vishay.com/docs/20008/dcrcw.pdf?src-supplier=Avnet+Europe; ComponentLink2URL: https://www.verical.com/server-webapp/html/getDatasheet?partID=86831&src-supplier=Verical; ComponentLink2Description: https://www.verical.com/server-webapp/html/getDatasheet?partID=86831&src-supplier=Verical; ComponentLink3URL: http://www.farnell.com/datasheets/2310790.pdf?src-supplier=Allied+Electronics; ComponentLink3Description: http://www.farnell.com/datasheets/2310790.pdf?src-supplier=Allied+Electronics; ComponentLink4URL: http://www.vishay.com/docs/20035/dcrcwe3.pdf?src-supplier=Digi-Key; ComponentLink4Description: http://www.vishay.com/docs/20035/dcrcwe3.pdf?src-supplier=Digi-Key; ComponentLink5URL: http://www.farnell.com/datasheets/2310790.pdf?src-supplier=Mouser; ComponentLink5Description: http://www.farnell.com/datasheets/2310790.pdf?src-supplier=Mouser; ComponentLink6URL: http://www.farnell.com/datasheets/2310790.pdf?src-supplier=Element14; ComponentLink6Description: http://www.farnell.com/datasheets/2310790.pdf?src-supplier=Element14; ComponentLink7URL: http://www.farnell.com/datasheets/2310790.pdf?src-supplier=Avnet; ComponentLink7Description: http://www.farnell.com/datasheets/2310790.pdf?src-supplier=Avnet; ComponentLink8URL: http://www.vishay.com/docs/20035/dcrcwe3.pdf?src-supplier=Future+Electronics; ComponentLink8Description: http://www.vishay.com/docs/20035/dcrcwe3.pdf?src-supplier=Future+Electronics; ComponentLink9URL: http://uk.rs-online.com/webdocs/0d98/0900766b80d98afc.pdf?src-supplier=RSComponents; ComponentLink9Description: http://uk.rs-online.com/webdocs/0d98/0900766b80d98afc.pdf?src-supplier=RSComponents; ComponentLink10URL: http://www.farnell.com/datasheets/2310790.pdf?src-supplier=Distrelec; ComponentLink10Description: http://www.farnell.com/datasheets/2310790.pdf?src-supplier=Distrelec; Supplier Part Number 1: 541-10.0KHCT-ND; Category: Resistors
R12 R17 = CRCW06031K00FKEA: as R6 on sheet SDC-rev2; Supplier 1: Digi-Key; Manufacturer Part Number: CRCW06031K00FKEA; Stock 1: 1811474; Pricing 1: 1=0.1, 10=0.034, 100=0.0139, 1000=0.00623, 2500=0.0054 (USD); Mount: Surface Mount; Case/Package: 0603; Number of Pins: 2; Weight: 7.1E-05oz; Contact Plating: Tin; Case Code (Metric): 1608; Case Code (Imperial): 0603; Min Operating Temperature: -55°C; Max Operating Temperature: 155°C; Composition: Thick Film; Tolerance: 1%; Termination: SMD/SMT; Packaging: Tape and Reel; Package Quantity: 10; Number of Terminations: 2; Military Standard: Not; Max Power Dissipation: 100mW; Voltage Rating (DC): 75V; Features: Automotive AEC-Q200; Length: 1.55mm; Height: 0.45mm; Width: 0.033inch; Depth: 0.85mm; Radiation Hardening: No; Lead Free: Lead Free; REACH SVHC: Unknown; ComponentLink1URL: http://www.vishay.com/docs/20035/dcrcwe3.pdf?src-supplier=Digi-Key; ComponentLink1Description: http://www.vishay.com/docs/20035/dcrcwe3.pdf?src-supplier=Digi-Key; ComponentLink2URL: http://uk.rs-online.com/webdocs/0d98/0900766b80d98afc.pdf?src-supplier=RSComponents; ComponentLink2Description: http://uk.rs-online.com/webdocs/0d98/0900766b80d98afc.pdf?src-supplier=RSComponents; ComponentLink3URL: http://www.vishay.com/docs/20035/dcrcwe3.pdf?src-supplier=Avnet; ComponentLink3Description: http://www.vishay.com/docs/20035/dcrcwe3.pdf?src-supplier=Avnet; ComponentLink4URL: http://www.vishay.com/docs/20035/dcrcwe3.pdf?src-supplier=Avnet+Asia; ComponentLink4Description: http://www.vishay.com/docs/20035/dcrcwe3.pdf?src-supplier=Avnet+Asia; ComponentLink5URL: http://www.farnell.com/datasheets/2310790.pdf?src-supplier=Element14; ComponentLink5Description: http://www.farnell.com/datasheets/2310790.pdf?src-supplier=Element14; ComponentLink6URL: https://www.distrelec.biz/Web/Downloads/a_/en/flD-CRCW-e3_data_en.pdf?mime=application%2Fpdf&src-supplier=Distrelec; ComponentLink6Description: https://www.distrelec.biz/Web/Downloads/a_/en/flD-CRCW-e3_data_en.pdf?mime=application%2Fpdf&src-supplier=Distrelec; ComponentLink7URL: http://www.vishay.com/docs/20035/dcrcwe3.pdf?src-supplier=Future+Electronics; ComponentLink7Description: http://www.vishay.com/docs/20035/dcrcwe3.pdf?src-supplier=Future+Electronics; ComponentLink8URL: http://www.vishay.com/docs/20035/dcrcwe3.pdf?src-supplier=Avnet+Europe; ComponentLink8Description: http://www.vishay.com/docs/20035/dcrcwe3.pdf?src-supplier=Avnet+Europe; Supplier Part Number 1: 541-1.00KHCT-ND; Category: Resistors
R13 R15 R20 = RMCF0603JT3K00: RES 3K OHM 5% 1/10W 0603
R14 R18 = RMCF0603FT9K10: RES 9.1K OHM 1% 1/10W 0603
R19 = RNCP0603FTD7K50: RES 7.5K OHM 1% 1/8W 0603
R21 = MCT06030C1301FP500: RES SMD 1.3K OHM 1% 1/8W 0603
R22 = RC0603FR-072K2L: RES SMD 2.2K OHM 1% 1/10W 0603
R23 = RC0603FR-0733KL: RES SMD 33K OHM 1% 1/10W 0603
R24 = ERA-3AEB4990V: RES SMD 499 OHM 0.1% 1/10W 0603
U8 U14 = TLV3202AIDGK: IC COMPAR PWR RRI DL PP 8VSSOP; Manufacturer: Texas Instruments; Min Supply Voltage: 2.7V; Max Supply Voltage: 5.5V; Number of Elements: 2; Nominal Supply Current: 50uA; Max Supply Current: 40uA; Input Bias Current: 50pA; Input Offset Voltage (Vos): 5mV; Response Time: 0.047us; Propagation Delay: 50ns; Common Mode Rejection Ratio: 70dB; Hysteresis: 1.2mV; Power Supply Rejection Ratio (PSRR): 85dB; ComponentLink1Description: digikey.ca; ComponentLink1URL: https://www.digikey.ca/product-detail/en/texas-instruments/TLV3202AIDGK/296-34992-ND/3588984; Supplier 1: Digi-Key; Manufacturer Part Number: TLV3202AIDGK; Stock 1: 14534; Pricing 1: 1=1.77, 80=1.5, 160=1.278, 560=1.05, 1040=0.87 (USD); Mount: Surface Mount; Case/Package: VSSOP; Number of Pins: 8; Min Operating Temperature: -40°C; Max Operating Temperature: 125°C; Packaging: Rail/Tube; Package Quantity: 80; Number of Channels: 2; Max Input Current: 50pA; Quiescent Current: 50uA; Type: General Purpose; Length: 3.1mm; Height: 0.95mm; Width: 3.1mm; Radiation Hardening: No; Lead Free: Lead Free; REACH SVHC: No SVHC; ComponentLink2URL: https://datasheet.ciiva.com/12288/tlv3202-193866-12288098.pdf; ComponentLink2Description: https://datasheet.ciiva.com/12288/tlv3202-193866-12288098.pdf; ComponentLink3URL: https://datasheet.ciiva.com/23702/1645741-23702136.pdf; ComponentLink3Description: https://datasheet.ciiva.com/23702/1645741-23702136.pdf; ComponentLink4URL: https://datasheet.ciiva.com/8066/1645741-8066013.pdf; ComponentLink4Description: https://datasheet.ciiva.com/8066/1645741-8066013.pdf; Supplier Part Number 1: 296-34992-ND; Supplier 2: Digi-Key
U9 = NL27WZ32USGOSCT-ND: IC GATE OR 2CH 2-INP US8; Manufacturer: ON Semiconductor; Number of Gates: 2; Propagation Delay: 6.2ns; Max Supply Voltage: 5.5V; Min Supply Voltage: 1.65V; Number of Outputs: 1; Operating Supply Voltage: 3.25V; Schmitt Trigger Input: No; Low Level Output Current: 32mA; Quiescent Current: 1uA; High Level Output Current: -32mA; Turn-On Delay Time: 5.2ns; Output Current: 50mA; Supplier 1: Digi-Key; Manufacturer Part Number: NL27WZ32USG; Stock 1: 5684; Pricing 1: 1=0.39000, 10=0.31700, 25=0.29000, 100=0.21570, 250=0.19548, 500=0.16176, 1000=0.12132 (USD); RoHS: Yes; Mount: Surface Mount; Number of Pins: 8; Contact Plating: Tin,Matte; Min Operating Temperature: -40°C; Max Operating Temperature: 85°C; Packaging: Tape and Reel; Package Quantity: 1; Number of Inputs: 2; Logic Function: OR; Number of Circuits: 2; Number of Elements: 2; Length: 2.4mm; Height: 0.8mm; Width: 2.1mm; Radiation Hardening: No; REACH SVHC: No SVHC; Lead Free: Lead Free; Halogen Free: Halogen Free; ComponentLink1URL: https://datasheet.ciiva.com/8277/nl27wz32-d-8277742.pdf?src-supplier=Avnet; ComponentLink1Description: https://datasheet.ciiva.com/8277/nl27wz32-d-8277742.pdf?src-supplier=Avnet; ComponentLink2URL: https://datasheet.ciiva.com/4820/nl27wz32-d-114831-4820790.pdf?src-supplier=Mouser; ComponentLink2Description: https://datasheet.ciiva.com/4820/nl27wz32-d-114831-4820790.pdf?src-supplier=Mouser; ComponentLink3URL: https://datasheet.ciiva.com/15090/getdatasheetpartid-69948-15090488.pdf?src-supplier=Verical; ComponentLink3Description: https://datasheet.ciiva.com/15090/getdatasheetpartid-69948-15090488.pdf?src-supplier=Verical; ComponentLink4URL: https://datasheet.ciiva.com/26864/nl27wz32usg-26864780.pdf?src-supplier=IIIC; ComponentLink4Description: https://datasheet.ciiva.com/26864/nl27wz32usg-26864780.pdf?src-supplier=IIIC; ComponentLink5URL: https://datasheet.ciiva.com/1872/nl27wz32-d-1872823.pdf?src-supplier=Digi-Key; ComponentLink5Description: https://datasheet.ciiva.com/1872/nl27wz32-d-1872823.pdf?src-supplier=Digi-Key; ComponentLink6URL: https://datasheet.ciiva.com/26049/nl27wz32-d-26049116.pdf?src-supplier=Avnet+Europe; ComponentLink6Description: https://datasheet.ciiva.com/26049/nl27wz32-d-26049116.pdf?src-supplier=Avnet+Europe; ComponentLink7URL: https://datasheet.ciiva.com/1872/nl27wz32-d-1872824.pdf?src-supplier=Digi-Key; ComponentLink7Description: https://datasheet.ciiva.com/1872/nl27wz32-d-1872824.pdf?src-supplier=Digi-Key; ComponentLink8URL: https://datasheet.ciiva.com/1872/nl27wz32-d-1872825.pdf?src-supplier=Digi-Key; ComponentLink8Description: https://datasheet.ciiva.com/1872/nl27wz32-d-1872825.pdf?src-supplier=Digi-Key; ComponentLink9URL: https://datasheet.ciiva.com/16471/nl27wz32-d-16471564.pdf?src-supplier=Future+Electronics; ComponentLink9Description: https://datasheet.ciiva.com/16471/nl27wz32-d-16471564.pdf?src-supplier=Future+Electronics; Supplier Part Number 1: NL27WZ32USGOSCT-ND
U10 = SN74LVC2G08DCUT: Dual 2-Input Positive-AND Gate; Manufacturer: Texas Instruments; Output Current: 32mA; Number of Inputs: 2; Min Supply Voltage: 1.65V; Max Supply Voltage: 5.5V; Logic Function: AND; Number of Outputs: 1; Propagation Delay: 3.8ns; Quiescent Current: 10uA; High Level Output Current: -32mA; Supplier 1: Digi-Key; ComponentLink1Description: Digi-Key; ComponentLink1URL: https://www.digikey.ca/product-detail/en/texas-instruments/SN74LVC2G08DCUT/296-26615-1-ND/2255073; Supplier Part Number 1: 296-26615-1-ND; Manufacturer Part Number: SN74LVC2G08DCUT; Stock 1: 2440; Pricing 1: 1=0.86, 10=0.769, 100=0.5994 (USD); Mount: Surface Mount; Case/Package: VSSOP; Number of Pins: 8; Weight: 0.000339oz; Contact Plating: Gold; Min Operating Temperature: -40°C; Max Operating Temperature: 125°C; Max Output Current: 32mA; Packaging: Tape and Reel; Package Quantity: 1; Number of Gates: 2; Number of Input Lines: 2; Number of Output Lines: 1; Low Level Output Current: 32mA; Number of Circuits: 2; Number of Elements: 2; Turn-On Delay Time: 3.8ns; Termination: SMD/SMT; Number of Bits: 2; Radiation Hardening: No; REACH SVHC: No SVHC; Lead Free: Lead Free; ComponentLink2URL: http://focus.ti.com/lit/ds/symlink/sn74lvc2g08.pdf?src-supplier=Element14; ComponentLink2Description: http://focus.ti.com/lit/ds/symlink/sn74lvc2g08.pdf?src-supplier=Element14; ComponentLink3URL: http://focus.ti.com/lit/ds/symlink/sn74lvc2g08.pdf?src-supplier=Avnet; ComponentLink3Description: http://focus.ti.com/lit/ds/symlink/sn74lvc2g08.pdf?src-supplier=Avnet; ComponentLink4URL: http://www.ti.com/general/docs/lit/getliterature.tsp?genericPartNumber=SN74LVC2G08&&fileType=pdf&src-supplier=Avnet; ComponentLink4Description: http://www.ti.com/general/docs/lit/getliterature.tsp?genericPartNumber=SN74LVC2G08&&fileType=pdf&src-supplier=Avnet; ComponentLink5URL: https://www.verical.com/server-webapp/html/getDatasheet?partID=48823&src-supplier=Verical; ComponentLink5Description: https://www.verical.com/server-webapp/html/getDatasheet?partID=48823&src-supplier=Verical; ComponentLink6URL: http://www.farnell.com/datasheets/1834894.pdf?src-supplier=Element14; ComponentLink6Description: http://www.farnell.com/datasheets/1834894.pdf?src-supplier=Element14; ComponentLink7URL: http://www.ti.com/lit/ds/symlink/sn74lvc2g08.pdf?src-supplier=Digi-Key; ComponentLink7Description: http://www.ti.com/lit/ds/symlink/sn74lvc2g08.pdf?src-supplier=Digi-Key; ComponentLink8URL: http://www.produktinfo.conrad.com/datenblaetter/1000000-1099999/001017175-da-01-en-IC_DU_2IN_PO_SN74LVC2G08DCUT_VSSOP_8_TID.pdf?src-supplier=Conrad; ComponentLink8Description: http://www.produktinfo.conrad.com/datenblaetter/1000000-1099999/001017175-da-01-en-IC_DU_2IN_PO_SN74LVC2G08DCUT_VSSOP_8_TID.pdf?src-supplier=Conrad
U11 U13 = SN74AHC1G04DCK: The SN74AHC1G04 contains one inverter gate. The / device performs the Boolean function Y = A bar.; Manufacturer: Texas Instruments; Manufacturer Part Number: SN74AHC1G04DCKR; Output Current: 8mA; Number of Inputs: 1; Min Supply Voltage: 2V; Max Supply Voltage: 5.5V; Logic Function: Buffer,Inverter,Inverting; Propagation Delay: 12ns; Quiescent Current: 1uA; High Level Output Current: -8mA; Turn-On Delay Time: 10.6ns; Schmitt Trigger Input: No; Supplier 1: Digi-Key; ComponentLink1Description: Digi-Key; ComponentLink1URL: https://www.digikey.com/product-detail/en/texas-instruments/SN74AHC1G04DCKR/296-1090-1-ND/276358; Supplier Part Number 1: 296-1090-1-ND; Stock 1: 120362; Pricing 1: 1=0.43, 10=0.32, 100=0.1996, 500=0.13658, 1000=0.10506 (USD); Mount: Surface Mount; Case/Package: SC; Number of Pins: 5; Weight: 8.8E-05oz; Contact Plating: Gold; Min Operating Temperature: -40°C; Max Operating Temperature: 125°C; Max Output Current: 8mA; Number of Elements: 1; Packaging: Tape and Reel; Package Quantity: 1; Number of Circuits: 1; Low Level Output Current: 8mA; Termination: SMD/SMT; Number of Gates: 1; Number of Bits: 1; Length: 2mm; Height: 0.9mm; Width: 1.25mm; Radiation Hardening: No; REACH SVHC: No SVHC; Lead Free: Lead Free; ComponentLink2URL: http://www.farnell.com/datasheets/1759812.pdf?src-supplier=Element14; ComponentLink2Description: http://www.farnell.com/datasheets/1759812.pdf?src-supplier=Element14; ComponentLink3URL: http://www.jameco.com/Jameco/Products/ProdDS/912915.pdf?src-supplier=Jameco; ComponentLink3Description: http://www.jameco.com/Jameco/Products/ProdDS/912915.pdf?src-supplier=Jameco; ComponentLink4URL: http://www.ti.com/lit/ds/symlink/sn74ahc1g04.pdf?src-supplier=Digi-Key; ComponentLink4Description: http://www.ti.com/lit/ds/symlink/sn74ahc1g04.pdf?src-supplier=Digi-Key; ComponentLink5URL: https://www.verical.com/server-webapp/html/getDatasheet?partID=53378&src-supplier=Verical; ComponentLink5Description: https://www.verical.com/server-webapp/html/getDatasheet?partID=53378&src-supplier=Verical; ComponentLink6URL: http://www.farnell.com/datasheets/2024272.pdf?src-supplier=Element14; ComponentLink6Description: http://www.farnell.com/datasheets/2024272.pdf?src-supplier=Element14; ComponentLink7URL: http://www.ti.com/general/docs/lit/getliterature.tsp?genericPartNumber=SN74AHC1G04&amp;&amp;fileType=pdf&src-supplier=Avnet+Asia; ComponentLink7Description: http://www.ti.com/general/docs/lit/getliterature.tsp?genericPartNumber=SN74AHC1G04&amp;&amp;fileType=pdf&src-supplier=Avnet+Asia
U12 = TLV3201AIDCKR: Comparator Single R-R I/P 5.5V 5-Pin SC-70 T/R; Manufacturer: Texas Instruments; Common Mode Rejection Ratio: 85dB; Min Supply Voltage: 2.7V; Number of Elements: 1; Propagation Delay: 50ns; Nominal Supply Current: 50uA; Input Offset Voltage (Vos): 5mV; Input Bias Current: 5nA; Quiescent Current: 40uA; Hysteresis: 1.2mV; Response Time: 0.047us; Supplier 1: Digi-Key; Manufacturer Part Number: TLV3201AIDCKR; Stock 1: 34988; Pricing 1: 1=1.36000, 10=1.21500, 100=0.94760, 500=0.78280, 1000=0.61800 (USD); RoHS: Yes; Mount: Surface Mount; Case/Package: SOT-23-5; Number of Pins: 5; Min Operating Temperature: -40°C; Max Operating Temperature: 125°C; Max Supply Voltage: 5.5V; Packaging: Tape and Reel; Package Quantity: 3000; Max Input Current: 5nA; Max Supply Current: 40uA; Number of Channels: 1; Power Supply Rejection Ratio (PSRR): 85dB; Type: General Purpose; Radiation Hardening: No; Lead Free: Lead Free; ComponentLink1URL: https://datasheet.ciiva.com/29635/tlv3201-29635045.pdf?src-supplier=Digi-Key; ComponentLink1Description: https://datasheet.ciiva.com/29635/tlv3201-29635045.pdf?src-supplier=Digi-Key; ComponentLink2URL: https://datasheet.ciiva.com/2966/tlv3202-2966812.pdf?src-supplier=Avnet; ComponentLink2Description: https://datasheet.ciiva.com/2966/tlv3202-2966812.pdf?src-supplier=Avnet; Supplier Part Number 1: 296-36751-1-ND

## Nets that join several sheets
5V: SDC-rev2 (6 pins), BSPD-rev2 (21 pins)
GND: SDC-rev2 (15 pins), BSPD-rev2 (24 pins)
NetC1_2: SDC-rev2 (M2.1), BSPD-rev2 (5 pins)
NetC3_2: SDC-rev2 (M2.2), BSPD-rev2 (5 pins)
NetM2_3: SDC-rev2 (M2.3 Q1.5 R2.1), BSPD-rev2 (U13.4)